# EAGLE design M220C (EAGLE 6.6.0)
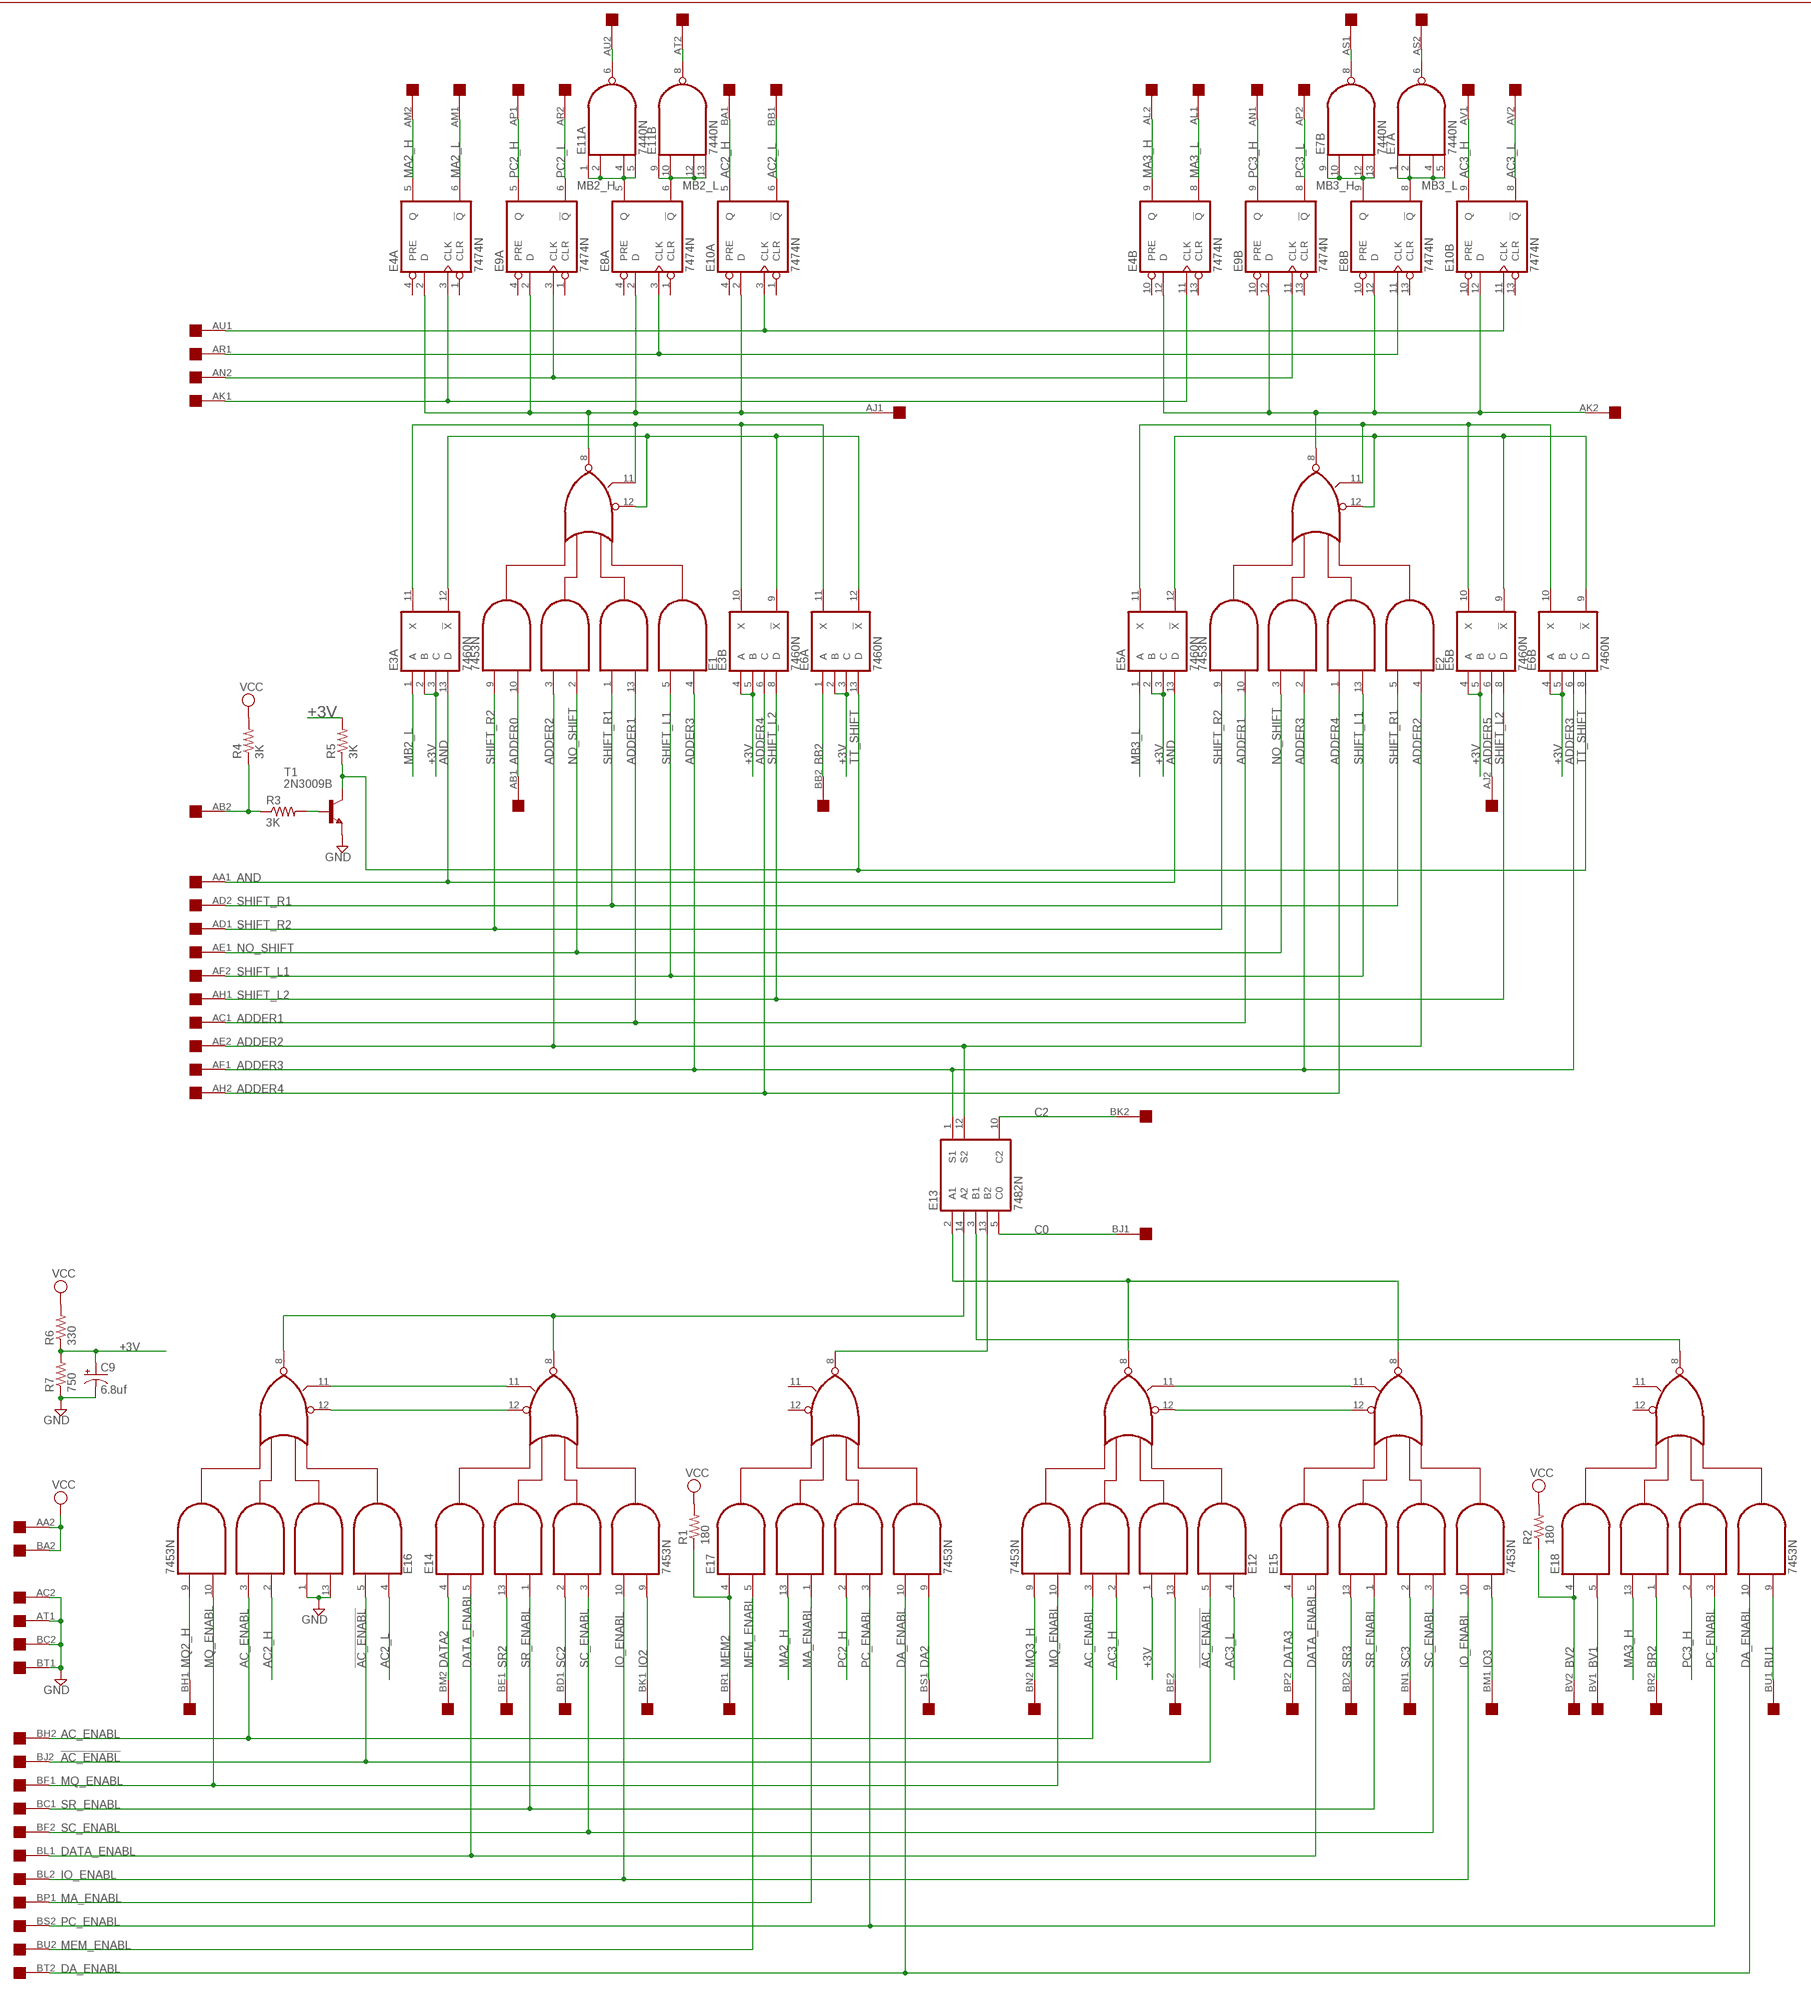
[diagram p0: schematic, sheet 1, part 1 of 2]
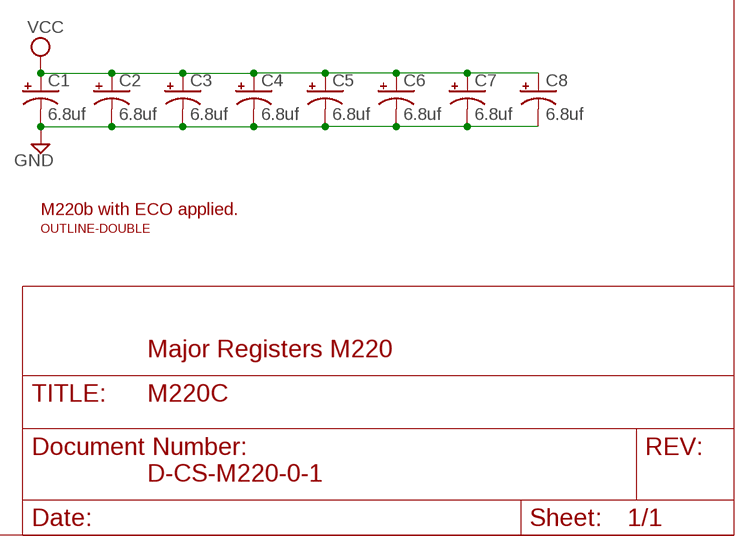
[diagram p1: schematic, sheet 1, part 2 of 2]

## Parts
C1  6.8uf  CPOL-USE15-5AXIAL  [E15-5]
C2  6.8uf  CPOL-USE15-5AXIAL  [E15-5]
C3  6.8uf  CPOL-USE15-5AXIAL  [E15-5]
C4  6.8uf  CPOL-USE15-5AXIAL  [E15-5]
C5  6.8uf  CPOL-USE15-5AXIAL  [E15-5]
C6  6.8uf  CPOL-USE15-5AXIAL  [E15-5]
C7  6.8uf  CPOL-USE15-5AXIAL  [E15-5]
C8  6.8uf  CPOL-USE15-5AXIAL  [E15-5]
C9  6.8uf  CPOL-USE15-5AXIAL  [E15-5]
E1  7453N  [DIL14]
E2  7453N  [DIL14]
E3  7460N  [DIL14]
E4  7474N  74S74N  [DIL14]
E5  7460N  [DIL14]
E6  7460N  [DIL14]
E7  7440N  74S20N  [DIL14]
E8  7474N  74S74N  [DIL14]
E9  7474N  74S74N  [DIL14]
E10  7474N  74S74N  [DIL14]
E11  7440N  74S20N  [DIL14]
E12  7453N  [DIL14]
E13  7482N  [DIL14]
E14  7453N  [DIL14]
E15  7453N  [DIL14]
E16  7453N  [DIL14]
E17  7453N  [DIL14]
E18  7453N  [DIL14]
R1  180  R-US_0207/10  [0207/10]
R2  180  R-US_0207/10  [0207/10]
R3  3K  R-US_0207/10  [0207/10]
R4  3K  R-US_0207/10  [0207/10]
R5  3K  R-US_0207/10  [0207/10]
R6  330  R-US_0207/10  [0207/10]
R7  750  R-US_0207/10  [0207/10]
T1  2N3009B  2N1613  [TO5]
U$1  DOUBLE  [EDGE-CON4]
U$2  OUTLINE-DOUBLE  [DOUBLE]

## Nets
!AC_ENABL: E12.5(I2) E16.5(I2) U$1.BJ2
!TT_SHIFT: R3.1 R4.1 U$1.AB2
+3V [Supply]: C9.+ E3.2(A:B) E3.3(A:C) E3.4(B:A) E3.5(B:B) E5.2(A:B) E5.3(A:C) E5.4(B:A) E5.5(B:B) E6.2(A:B) E6.3(A:C) E6.4(B:A) E6.5(B:B) E12.1(I4) R5.2 R6.1 R7.2
AC2_H: E10.5(A:Q) E16.2(I5) U$1.BA1
AC2_L: E10.6(A:!Q) E16.4(I1) U$1.BB1
AC3_H: E10.9(B:Q) E12.2(I5) U$1.AV1
AC3_L: E10.8(B:!Q) E12.4(I1) U$1.AV2
AC_ENABL: E12.3(I6) E16.3(I6) U$1.BH2
ADDER0: E1.10(I7) U$1.AB1
ADDER1: E1.13(I3) E2.10(I7) U$1.AC1
ADDER2: E1.3(I6) E2.4(I1) E13.12(S2) U$1.AE2
ADDER3: E1.4(I1) E2.2(I5) E6.6(B:C) E13.1(S1) U$1.AF1
ADDER4: E2.1(I4) E3.6(B:C) U$1.AH2
ADDER5: E5.6(B:C) U$1.AJ2
AJ1: E1.8(O) E4.2(A:D) E8.2(A:D) E9.2(A:D) E10.2(A:D) U$1.AJ1
AK1: E4.3(A:CLK) E4.11(B:CLK) U$1.AK1
AK2: E2.8(O) E4.12(B:D) E8.12(B:D) E9.12(B:D) E10.12(B:D) U$1.AK2
AN2: E9.3(A:CLK) E9.11(B:CLK) U$1.AN2
AND: E3.13(A:D) E5.13(A:D) U$1.AA1
AR1: E8.3(A:CLK) E8.11(B:CLK) U$1.AR1
AS1: E7.8(B:O) U$1.AS1
AS2: E7.6(A:O) U$1.AS2
AT2: E11.8(B:O) U$1.AT2
AU1: E10.3(A:CLK) E10.11(B:CLK) U$1.AU1
AU2: E11.6(A:O) U$1.AU2
BB2: E6.1(A:A) U$1.BB2
BE2: E12.13(I3) U$1.BE2
BR2: E18.1(I4) U$1.BR2
BU1: E18.9(I8) U$1.BU1
BV1: E18.5(I2) U$1.BV1
BV2: E18.4(I1) R2.1 U$1.BV2
C0: E13.5(C0) U$1.BJ1
C2: E13.10(C2) U$1.BK2
DA2: E17.9(I8) U$1.BS1
DA_ENABL: E17.10(I7) E18.10(I7) U$1.BT2
DATA2: E14.4(I1) U$1.BM2
DATA3: E15.4(I1) U$1.BP2
DATA_ENABL: E14.5(I2) E15.5(I2) U$1.BL1
GND [Supply]: C1.- C2.- C3.- C4.- C5.- C6.- C7.- C8.- C9.- E16.1(I4) E16.13(I3) R7.1 T1.1(E) U$1.AC2 U$1.AT1 U$1.BC2 U$1.BT1
IO2: E14.9(I8) U$1.BK1
IO3: E15.9(I8) U$1.BM1
IO_ENABL: E14.10(I7) E15.10(I7) U$1.BL2
MA2_H: E4.5(A:Q) E17.13(I3) U$1.AM2
MA2_L: E4.6(A:!Q) U$1.AM1
MA3_H: E4.9(B:Q) E18.13(I3) U$1.AL2
MA3_L: E4.8(B:!Q) U$1.AL1
MA_ENABL: E17.1(I4) U$1.BP1
MB2_H: E8.5(A:Q) E11.1(A:I0) E11.2(A:I1) E11.4(A:I2) E11.5(A:I3)
MB2_L: E3.1(A:A) E8.6(A:!Q) E11.9(B:I0) E11.10(B:I1) E11.12(B:I2) E11.13(B:I3)
MB3_H: E7.9(B:I0) E7.10(B:I1) E7.12(B:I2) E7.13(B:I3) E8.9(B:Q)
MB3_L: E5.1(A:A) E7.1(A:I0) E7.2(A:I1) E7.4(A:I2) E7.5(A:I3) E8.8(B:!Q)
MEM2: E17.4(I1) R1.1 U$1.BR1
MEM_ENABL: E17.5(I2) U$1.BU2
MQ2_H: E16.9(I8) U$1.BH1
MQ3_H: E12.9(I8) U$1.BN2
MQ_ENABL: E12.10(I7) E16.10(I7) U$1.BF1
N$2: E12.12(I9) E15.12(I9)
N$3: R3.2 T1.2(B)
N$4: E12.11(I10) E15.11(I10)
N$5: E13.14(A2) E14.8(O) E16.8(O)
N$6: E14.11(I10) E16.11(I10)
N$7: E14.12(I9) E16.12(I9)
N$8: E12.8(O) E13.2(A1) E15.8(O)
N$9: E2.12(I9) E5.9(B:!X) E5.12(A:!X) E6.9(B:!X)
N$10: E1.12(I9) E3.9(B:!X) E3.12(A:!X) E6.12(A:!X)
N$11: E2.11(I10) E5.10(B:X) E5.11(A:X) E6.10(B:X)
N$12: E13.13(B2) E17.8(O)
N$13: E1.11(I10) E3.10(B:X) E3.11(A:X) E6.11(A:X)
N$14: E13.3(B1) E18.8(O)
NO_SHIFT: E1.2(I5) E2.3(I6) U$1.AE1
PC2_H: E9.5(A:Q) E17.2(I5) U$1.AP1
PC2_L: E9.6(A:!Q) U$1.AR2
PC3_H: E9.9(B:Q) E18.2(I5) U$1.AN1
PC3_L: E9.8(B:!Q) U$1.AP2
PC_ENABL: E17.3(I6) E18.3(I6) U$1.BS2
SC2: E14.2(I5) U$1.BD1
SC3: E15.2(I5) U$1.BN1
SC_ENABL: E14.3(I6) E15.3(I6) U$1.BF2
SHIFT_L1: E1.5(I2) E2.13(I3) U$1.AF2
SHIFT_L2: E3.8(B:D) E5.8(B:D) U$1.AH1
SHIFT_R1: E1.1(I4) E2.5(I2) U$1.AD2
SHIFT_R2: E1.9(I8) E2.9(I8) U$1.AD1
SR2: E14.13(I3) U$1.BE1
SR3: E15.13(I3) U$1.BD2
SR_ENABL: E14.1(I4) E15.1(I4) U$1.BC1
TT_SHIFT: E6.8(B:D) E6.13(A:D) R5.1 T1.3(C)
VCC [Supply]: C1.+ C2.+ C3.+ C4.+ C5.+ C6.+ C7.+ C8.+ R1.2 R2.2 R4.2 R6.2 U$1.AA2 U$1.BA2
Unconnected: E1.6(SPARE) E2.6(SPARE) E4.1(A:CLR) E4.4(A:PRE) E4.10(B:PRE) E4.13(B:CLR) E8.1(A:CLR) E8.4(A:PRE) E8.10(B:PRE) E8.13(B:CLR) E9.1(A:CLR) E9.4(A:PRE) E9.10(B:PRE) E9.13(B:CLR) E10.1(A:CLR) E10.4(A:PRE) E10.10(B:PRE) E10.13(B:CLR) E12.6(SPARE) E13.6 E13.7 E13.8 E13.9 E14.6(SPARE) E15.6(SPARE) E16.6(SPARE) E17.6(SPARE) E17.11(I10) E17.12(I9) E18.6(SPARE) E18.11(I10) E18.12(I9)

## Notes on the sheet
- M220b with ECO applied.
- Major Registers M220
- D-CS-M220-0-1

## Power pins joined to a net without a drawn wire
GND: E1.7(GND) E2.7(GND) E3.7(P:GND) E4.7(P:GND) E5.7(P:GND) E6.7(P:GND) E7.7(P:GND) E8.7(P:GND) E9.7(P:GND) E10.7(P:GND) E11.7(P:GND) E12.7(GND) E13.11(GND) E14.7(GND) E15.7(GND) E16.7(GND) E17.7(GND) E18.7(GND)
VCC: E1.14(VCC) E2.14(VCC) E3.14(P:VCC) E4.14(P:VCC) E5.14(P:VCC) E6.14(P:VCC) E7.14(P:VCC) E8.14(P:VCC) E9.14(P:VCC) E10.14(P:VCC) E11.14(P:VCC) E12.14(VCC) E13.4(VCC) E14.14(VCC) E15.14(VCC) E16.14(VCC) E17.14(VCC) E18.14(VCC)

## Library data of the parts
C1-C9 = dec-con:CPOL-USE15-5AXIAL: 0.6" veresion of an electrolytic
E1 E2 E12 E14-E18 = dec-con:74*53: 4-2-3-2 input AND OR INVERTER gates
E3 E5 E6 = 74xx-us:74*60: Dual 4-input EXPANDER
E4 E8-E10 = 74xx-us:74*74: Dual D type positive edge triggered FLIP FLOP, preset and clear
E7 E11 = 74xx-us:74*20: Dual 4-input NAND gate
E13 = dec-con:74*82: 2-bit binary full ADDER Has the wrong GND pin in other libraries.
R1-R7 = rcl:R-US_: RESISTOR, American symbol
T1 = transistor:2N1613: NPN TRANSISTOR
U$1 = dec-con:DOUBLE: Double-Height DEC board
U$2 = dec-con:OUTLINE-*: Board outlines for DEC boards.

## Net classes
1 Supply: width 0.813 mm

## Board
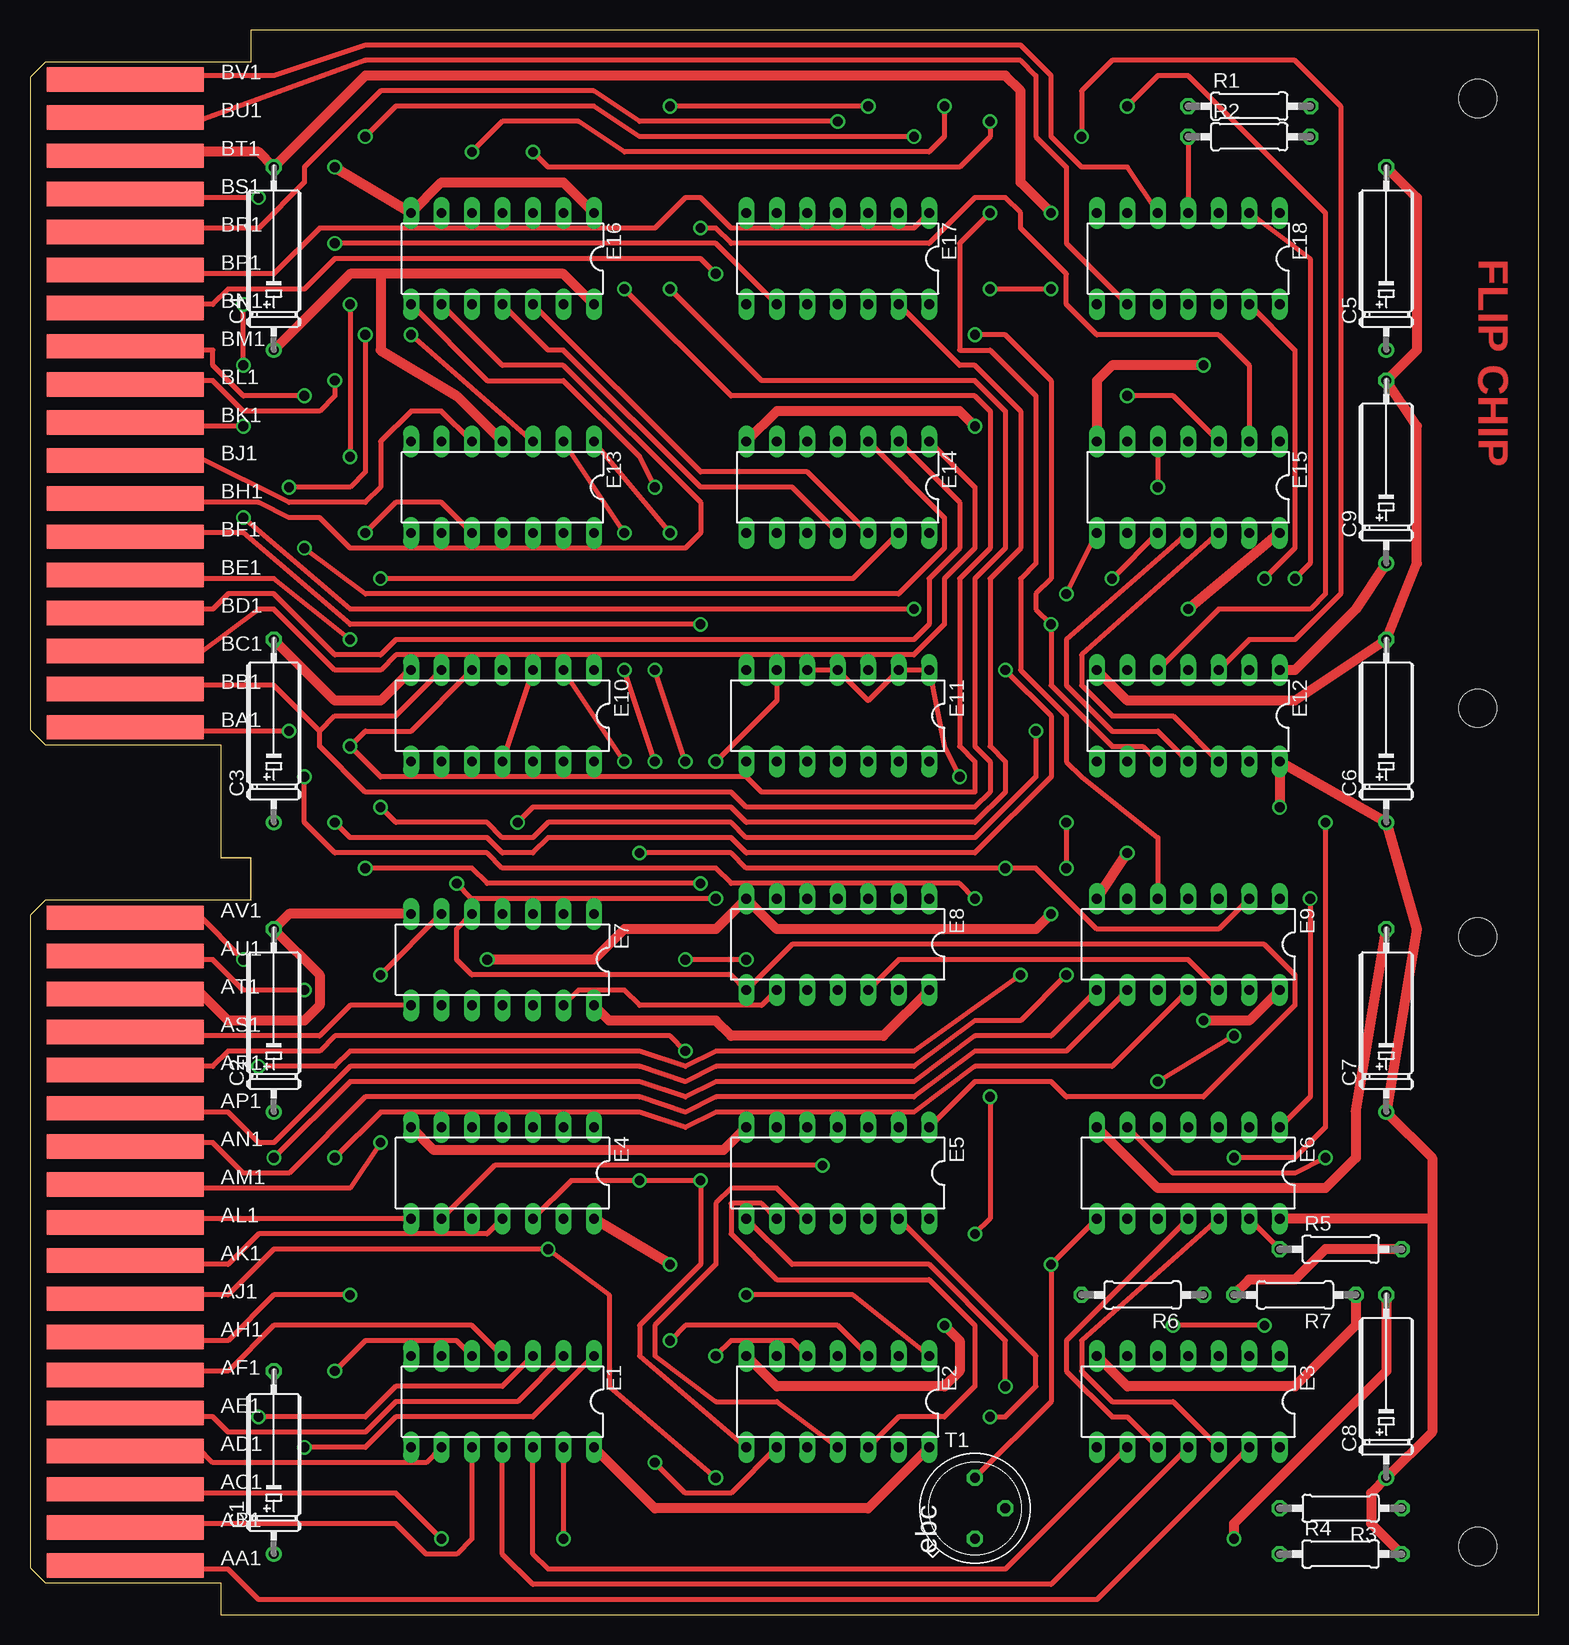
[diagram p2: board, top side]
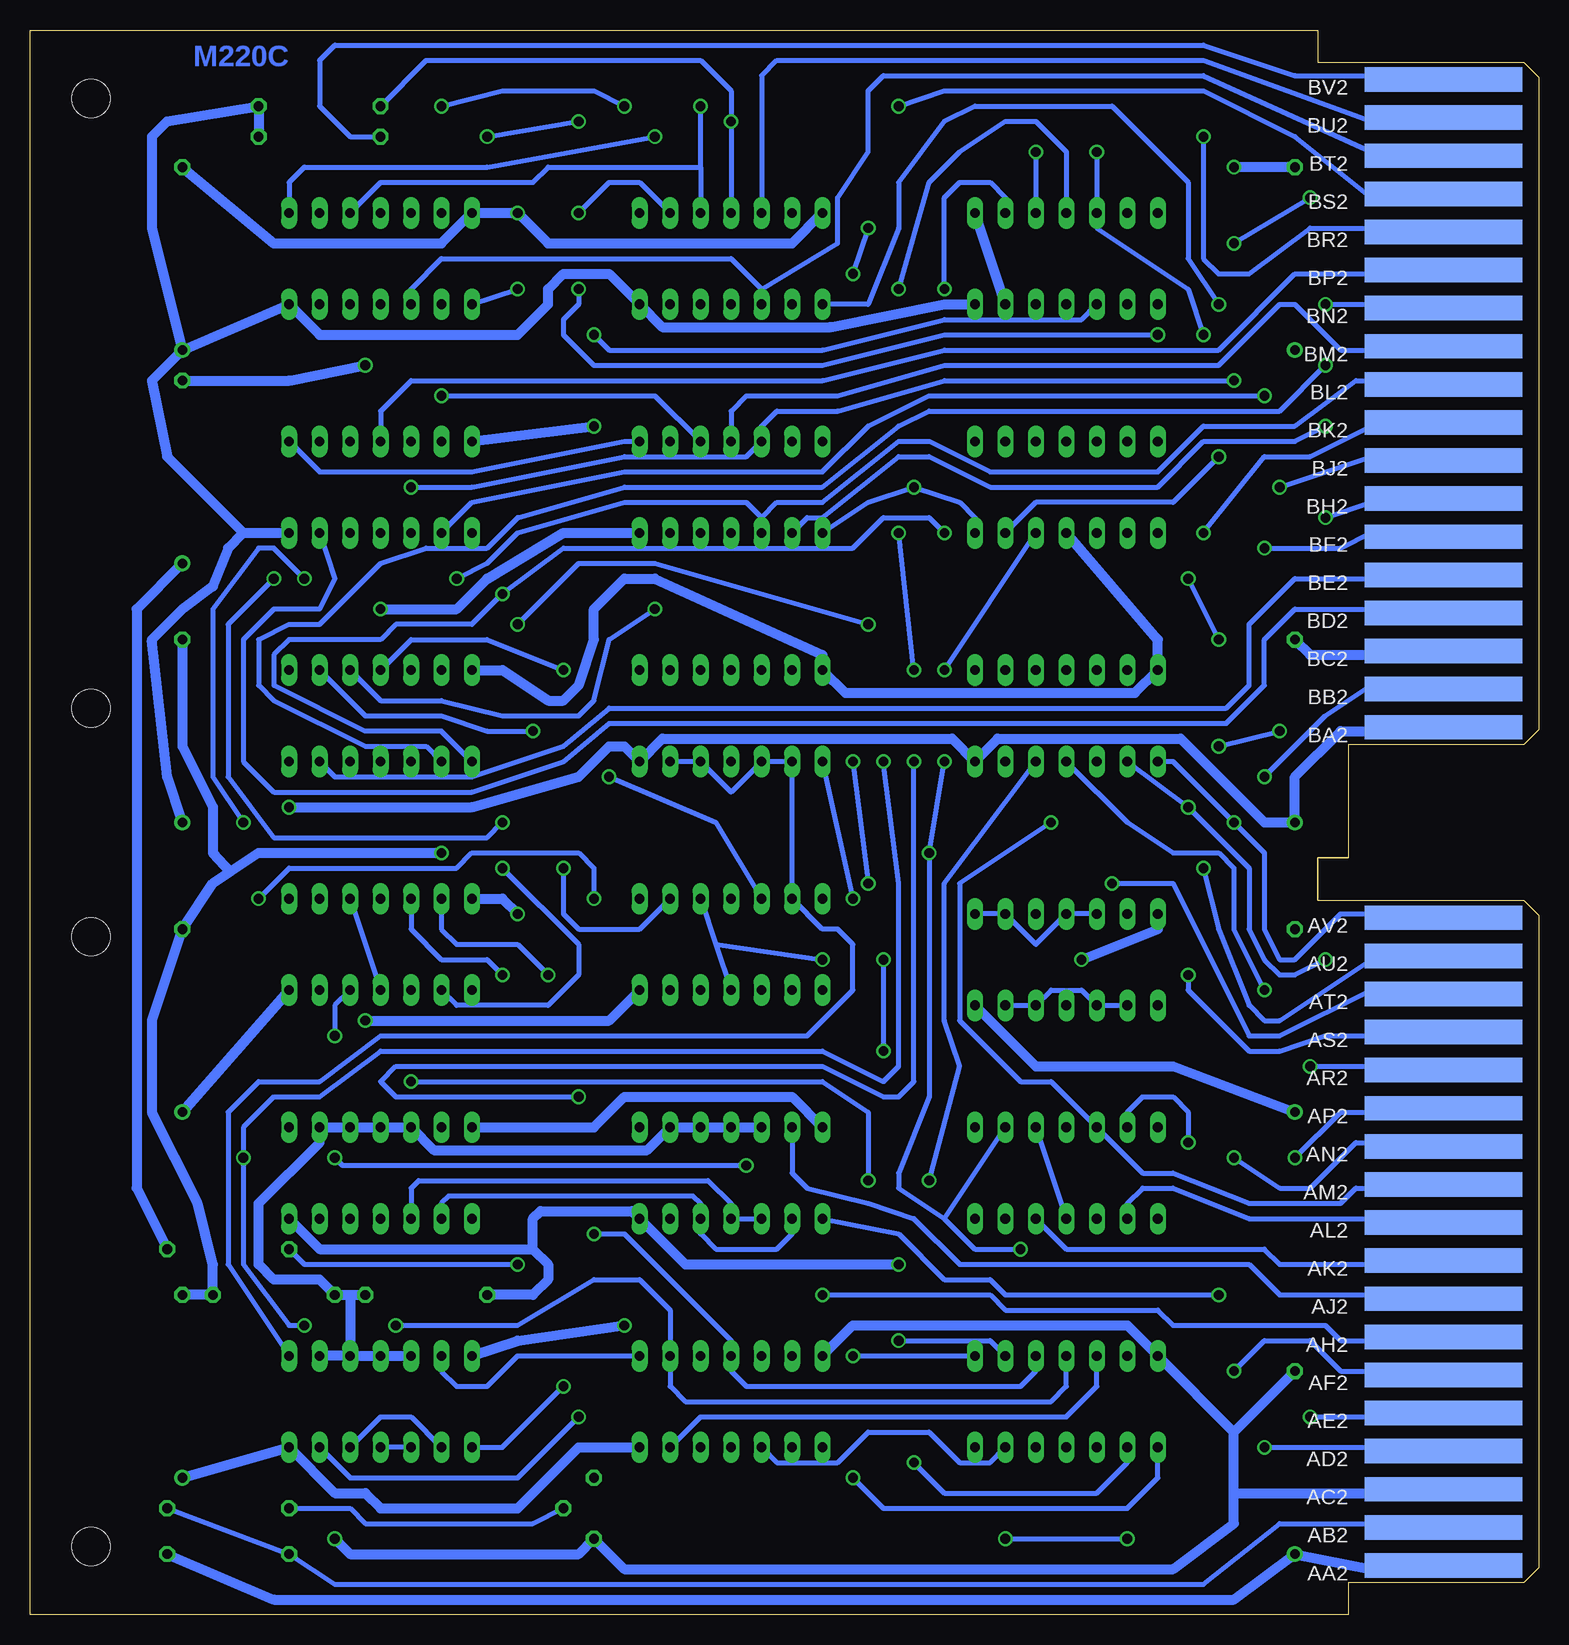
[diagram p3: board, bottom side, seen from below]

Size 125.73 x 132.08 mm. Coordinates in mm from the lower left corner, seen from the top.
Copper layers (1+15+16): Top 0.035mm / dielectric 1.5mm / ECO 0.035mm / dielectric 0.2mm / Bottom 0.035mm
Design rules "16mils *": minimum track width 16mil, minimum drill 32mil, track to track 15mil, track to pad 10mil, pad to pad 10mil, via to via 10mil, smd to smd 10mil, copper to edge 13mil, drill to drill 10mil, minimum pad ring 10mil, minimum via ring 8mil, stop-mask expansion 0mil, vias tented up to drill 0mil, thermal gap 10mil

### Footprints (pad centres in the part's own frame; a part is rotated, then mirrored left to right if it is on the bottom)
E15-5 = drill 0.813: + -7.62,0 | drill 0.813 octagon: - 7.62,0
DIL14 = drill 0.813 long: 1 -7.62,-3.81; 2 -5.08,-3.81; 3 -2.54,-3.81; 4 0,-3.81; 5 2.54,-3.81; 6 5.08,-3.81; 7 7.62,-3.81; 8 7.62,3.81; 9 5.08,3.81; 10 2.54,3.81; 11 0,3.81; 12 -2.54,3.81; 13 -5.08,3.81; 14 -7.62,3.81
0207/10 = drill 0.813 octagon: 1 -5.08,0; 2 5.08,0
TO5 = drill 0.813 octagon: 1 0,-2.54; 2 2.54,0; 3 0,2.54
EDGE-CON4 = smd 13.106 x 2.032: AA1 7.938,4.128; AB1 7.938,7.303; AC1 7.938,10.477; AD1 7.938,13.652; AE1 7.938,16.828; AF1 7.938,20.003; AH1 7.938,23.177; AJ1 7.938,26.352; AK1 7.938,29.527; AL1 7.938,32.703; AM1 7.938,35.877; AN1 7.938,39.053; AP1 7.938,42.227; AR1 7.938,45.403; AS1 7.938,48.578; AT1 7.938,51.752; AU1 7.938,54.928; AV1 7.938,58.102; BA1 7.938,73.978; BB1 7.938,77.153; BC1 7.938,80.328; BD1 7.938,83.502; BE1 7.938,86.677; BF1 7.938,89.853; BH1 7.938,93.028; BJ1 7.938,96.203; BK1 7.938,99.377; BL1 7.938,102.552; BM1 7.938,105.728; BN1 7.938,108.903; BP1 7.938,112.078; BR1 7.938,115.252; BS1 7.938,118.427; BT1 7.938,121.603; BU1 7.938,124.778; BV1 7.938,127.953 | smd 13.106 x 2.032 bottom: AA2 7.938,4.128; AB2 7.938,7.303; AC2 7.938,10.477; AD2 7.938,13.652; AE2 7.938,16.828; AF2 7.938,20.003; AH2 7.938,23.177; AJ2 7.938,26.352; AK2 7.938,29.527; AL2 7.938,32.703; AM2 7.938,35.877; AN2 7.938,39.053; AP2 7.938,42.227; AR2 7.938,45.403; AS2 7.938,48.578; AT2 7.938,51.752; AU2 7.938,54.928; AV2 7.938,58.102; BA2 7.938,73.978; BB2 7.938,77.153; BC2 7.938,80.328; BD2 7.938,83.502; BE2 7.938,86.677; BF2 7.938,89.853; BH2 7.938,93.028; BJ2 7.938,96.203; BK2 7.938,99.377; BL2 7.938,102.552; BM2 7.938,105.728; BN2 7.938,108.903; BP2 7.938,112.078; BR2 7.938,115.252; BS2 7.938,118.427; BT2 7.938,121.603; BU2 7.938,124.778; BV2 7.938,127.953
DOUBLE = hole 3.175: 120.65,56.515; 120.65,5.715; 120.65,75.565; 120.65,126.365

### Placement (x,y rotation side)
C1  20.32,12.7 90 top
C2  20.32,49.53 90 top
C3  20.32,73.66 90 top
C4  20.32,113.03 90 top
C5  113.03,113.03 90 top
C6  113.03,73.66 90 top
C7  113.03,49.53 90 top
C8  113.03,19.05 90 top
C9  113.03,95.25 90 top
E1  39.37,17.78 180 top
E2  67.31,17.78 180 top
E3  96.52,17.78 180 top
E4  39.37,36.83 180 top
E5  67.31,36.83 180 top
E6  96.52,36.83 180 top
E7  39.37,54.61 180 top
E8  67.31,55.88 180 top
E9  96.52,55.88 180 top
E10  39.37,74.93 180 top
E11  67.31,74.93 180 top
E12  96.52,74.93 180 top
E13  39.37,93.98 180 top
E14  67.31,93.98 180 top
E15  96.52,93.98 180 top
E16  39.37,113.03 180 top
E17  67.31,113.03 180 top
E18  96.52,113.03 180 top
R1  101.6,125.73 0 top
R2  101.6,123.19 0 top
R3  109.22,8.89 180 top
R4  109.22,5.08 0 top
R5  109.22,30.48 0 top
R6  92.71,26.67 180 top
R7  105.41,26.67 180 top
T1  78.74,8.89 0 top
U$1  0,0 0 top
U$2  0,0 0 top
U$3  [FLIPCHIP]  125.73,132.08 180 top

### Tracks (layer width: path | path; a pad name or v marks a point on that pad's centre or on a via)
!AC_ENABL  (via drill 0.81)
  Top 0.406: v36.83,121.92 39.37,124.46 45.72,124.46 49.53,121.92 74.93,121.92 76.2,123.19 v76.2,125.73 | v91.44,125.73 93.98,128.27 96.52,128.27 107.95,116.84 107.95,85.09 106.68,83.82 99.06,83.82 E12.5 | v21.59,93.98 26.67,93.98 27.94,95.25 v27.94,106.68
  Bottom 0.406: v36.83,121.92 E16.5 36.83,115.57 29.21,110.49 v27.94,106.68 | U$1.BJ2 8.89,96.52 13.97,96.52 v21.59,93.98 | v91.44,125.73 86.36,127 78.74,127 v76.2,125.73
!TT_SHIFT
  Bottom 0.406: R3.1 R4.1 100.33,2.54 27.94,2.54 21.59,7.62 10.16,7.62
  Bottom 0.813: 10.16,7.62 U$1.AB2
+3V
  Top 0.813: R5.2 107.95,30.48 105.41,27.94 101.6,27.94 R7.2 | E12.1 105.41,78.74 110.49,83.82 C9.+
  Bottom 0.813: E3.5 E3.4 E3.3 | E3.3 E3.2 | 99.06,26.67 R7.2 101.6,27.94 105.41,27.94 106.68,29.21 106.68,34.29 101.6,39.37 E6.2 E6.3 E6.4 E6.5 92.08,38.73 74.3,38.73 E5.2 E5.3 E5.4 E5.5 | 99.06,26.67 R6.1 | 99.06,26.67 E3.3 | C9.+ 116.84,83.82 116.84,35.56 R5.2
AC2_H  (via drill 0.81)
  Top 0.406: U$1.BA1 8.89,73.66 v21.59,73.66 | v49.53,110.49 58.42,101.6 78.74,101.6 80.01,100.33 80.01,88.9 77.47,86.36 77.47,72.39 78.74,71.12 78.74,68.58 60.96,68.58 59.69,69.85 29.21,69.85 v26.67,72.39 27.94,73.66 31.75,73.66 E10.5
  Bottom 0.406: E16.2 44.45,118.11 45.72,119.38 48.26,119.38 49.53,118.11 v49.53,110.49 | v26.67,72.39 v21.59,73.66
AC2_L  (via drill 0.81)
  Top 0.406: U$1.BB1 8.89,77.47 20.32,77.47 24.13,73.66 | 24.13,73.66 24.13,72.39 27.94,68.58 58.42,68.58 59.69,67.31 78.74,67.31 80.01,68.58 80.01,71.12 78.74,72.39 78.74,86.36 81.28,88.9 81.28,100.33 78.74,102.87 60.96,102.87 v53.34,110.49 | E10.6 30.48,74.93 25.4,74.93 24.13,73.66
  Bottom 0.406: E16.4 39.37,121.92 41.91,124.46 44.45,124.46 48.26,121.92 50.8,119.38 v53.34,110.49
AC3_H  (via drill 0.81)
  Top 0.406: U$1.AV1 8.06,58.42 13.97,58.42 v17.78,54.61 | v29.21,67.31 30.48,66.04 38.1,66.04 39.37,64.77 41.91,64.77 43.18,66.04 58.42,66.04 59.69,64.77 78.74,64.77 83.82,69.85 v83.82,73.66
  Bottom 0.406: E10.9 v29.21,67.31 24.13,62.23 24.13,57.15 22.86,54.61 21.59,53.34 20.32,53.34 v17.78,54.61 | E12.2 97.79,74.93 91.44,74.93 87.63,73.66 v83.82,73.66
AC3_L  (via drill 0.81)
  Top 0.406: v25.4,66.04 26.67,64.77 38.1,64.77 39.37,63.5 41.91,63.5 43.18,64.77 58.42,64.77 59.69,63.5 78.74,63.5 85.09,69.85 85.09,74.93 v81.28,78.74
  Bottom 0.406: U$1.AV2 8.5,58.03 8.89,58.42 16.51,58.42 20.32,54.61 21.59,54.61 22.86,57.15 22.86,63.5 v25.4,66.04 30.48,71.12 E10.8 | E12.4 93.98,81.28 87.63,81.28 v81.28,78.74
AC_ENABL  (via drill 0.81)
  Top 0.406: v41.91,121.92 43.18,120.65 77.47,120.65 80.01,123.19 v80.01,124.46 | E12.3 101.6,81.28 105.41,81.28 109.22,85.09 109.22,125.73 105.41,129.54 90.17,129.54 87.63,127 v87.63,123.19 | v73.66,83.82 26.67,83.82 v17.78,91.44
  Bottom 0.406: E12.3 96.52,76.2 91.44,76.2 86.36,74.93 80.01,74.93 78.74,76.2 77.47,81.28 v73.66,83.82 | v41.91,121.92 E16.3 | U$1.BH2 8.89,92.71 13.97,92.71 v17.78,91.44 | v87.63,123.19 v80.01,124.46
ADDER0
  Top 0.406: 8.89,7.62 30.48,7.62 33.02,5.08 35.56,5.08 36.83,6.35 E1.10
  Top 0.813: 8.89,7.62 U$1.AB1
ADDER1  (via drill 0.81)
  Top 0.406: E1.13 v44.45,6.35 | U$1.AC1 8.89,10.16 30.48,10.16 v34.29,6.35
  Bottom 0.406: v44.45,6.35 v34.29,6.35 | E1.13 45.72,12.7 48.26,12.7 50.8,15.24 55.88,15.24 58.42,12.7 63.5,12.7 E2.10
ADDER2  (via drill 0.81)
  Top 0.406: v78.74,31.75 80.01,33.02 v80.01,43.18 | v19.05,16.51 27.94,16.51 30.48,19.05 39.37,19.05 E1.3 | v52.07,71.12 v49.53,78.74
  Bottom 0.406: E1.3 41.91,20.32 43.18,19.05 66.04,19.05 67.31,20.32 E2.4 67.31,22.86 76.2,31.75 v78.74,31.75 | U$1.AE2 11.1,16.84 11.43,16.51 v19.05,16.51 | v49.53,78.74 E13.12 | v80.01,43.18 95.25,43.18 96.52,44.45 95.25,45.72 59.69,45.72 54.61,43.18 53.34,43.18 52.07,44.45 v52.07,71.12
ADDER3  (via drill 0.81)
  Top 0.406: v102.87,24.13 v95.25,24.13 | U$1.AF1 10.16,20.32 16.51,20.32 20.32,24.13 36.83,24.13 E1.4 | E6.6 95.25,36.83 105.41,36.83 v107.95,38.1 | v54.61,71.12 v52.07,78.74 | v53.34,90.17 E13.1
  Bottom 0.406: E1.4 39.37,19.05 40.64,17.78 71.12,17.78 72.39,19.05 E2.2 72.39,25.4 74.93,27.94 78.74,27.94 85.09,24.13 v95.25,24.13 | v102.87,24.13 104.14,24.13 107.95,29.21 v107.95,38.1 107.95,40.64 105.41,43.18 101.6,43.18 96.52,46.99 59.69,46.99 54.61,44.45 53.34,45.72 53.34,60.96 v54.61,71.12 | v52.07,78.74 v53.34,90.17
ADDER4  (via drill 0.81)
  Top 0.406: v59.69,26.67 68.58,26.67 E2.1
  Bottom 0.406: E3.6 91.44,20.32 90.17,19.05 87.63,19.05 85.09,21.59 E2.1 | U$1.AH2 9.83,23.19 10.16,22.86 16.51,22.86 17.78,24.13 30.48,24.13 31.75,25.4 44.45,25.4 45.72,26.67 v59.69,26.67
ADDER5
  Bottom 0.406: U$1.AJ2 8.56,26.34 8.89,26.67 21.59,26.67 24.13,29.21 48.26,29.21 52.07,33.02 55.88,34.29 60.96,35.56 62.23,36.83 E5.6
AJ1  (via drill 0.81)
  Top 0.406: v57.15,11.43 48.26,19.05 48.26,26.67 v43.18,30.48 20.32,30.48 16.51,26.67 8.89,26.67 U$1.AJ1 | v50.8,63.5 58.42,63.5 59.69,62.23 v81.28,62.23 83.82,62.23 88.9,57.15 99.06,57.15 E9.2 | v49.53,71.12 E10.2
  Bottom 0.406: E1.8 31.75,11.43 34.29,8.89 54.61,8.89 v57.15,11.43 | E8.2 74.93,57.15 80.01,57.15 81.28,58.42 v81.28,62.23 | 49.53,33.02 E4.2 | 49.53,33.02 46.99,30.48 v43.18,30.48 | 49.53,33.02 53.34,35.56 53.34,36.83 50.8,43.18 v50.8,63.5 v49.53,71.12
AK1
  Top 0.406: U$1.AK1 8.89,29.21 16.51,29.21 19.05,31.75 38.1,31.75 E4.11
  Bottom 0.406: E4.3 E4.11
AK2  (via drill 0.81)
  Top 0.406: v100.33,48.26 v93.98,44.45 | E4.12 45.09,36.2 v50.8,36.2 v55.88,36.2 55.88,29.21 50.8,24.13 50.8,21.59 E2.8 | E8.12 72.39,54.61 96.52,54.61 E9.12
  Bottom 0.406: U$1.AK2 9.86,29.52 10.16,29.21 21.59,29.21 22.86,30.48 39.37,30.48 E4.12 | E9.12 100.33,50.8 v100.33,48.26 | E10.12 49.53,60.96 49.53,49.53 48.26,45.72 v50.8,36.2 | v93.98,44.45 59.69,44.45 55.88,41.91 v55.88,36.2
AN2  (via drill 0.81)
  Top 0.406: v25.4,38.1 29.21,41.91 50.8,41.91 54.61,40.64 57.15,41.91 73.66,41.91 78.74,45.72 90.17,45.72 E9.11
  Bottom 0.406: E9.3 E9.11 | U$1.AN2 9.83,39.04 10.16,39.37 15.24,39.37 19.05,35.56 21.59,35.56 v25.4,38.1
AND  (via drill 0.81)
  Top 0.406: U$1.AA1 8.49,4.21 8.89,3.81 16.51,3.81 19.05,1.27 88.9,1.27 E3.13 | E5.13 83.82,21.59 83.82,19.05 81.28,16.51 v80.01,16.51
  Bottom 0.406: E3.13 99.06,11.43 85.09,11.43 v80.01,16.51
AR1  (via drill 0.81)
  Top 0.406: v59.69,54.61 v54.61,54.61 | v54.61,46.99 53.34,48.26 25.4,48.26 24.13,46.99 16.51,46.99 15.24,45.72 8.89,45.72 U$1.AR1
  Bottom 0.406: E8.3 68.58,55.88 | 68.58,55.88 E8.11 | 68.58,55.88 v59.69,54.61 | v54.61,54.61 v54.61,46.99
AS1
  Top 0.406: U$1.AS1 8.89,48.26 24.13,48.26 26.67,50.8 E7.8
AS2  (via drill 0.81)
  Top 0.406: E7.6 v29.21,53.34
  Bottom 0.406: U$1.AS2 8.59,48.56 8.89,48.26 17.78,48.26 21.59,46.99 24.13,46.99 29.21,52.07 v29.21,53.34
AT2  (via drill 0.81)
  Top 0.406: v35.56,60.96 36.83,59.69 v57.15,59.69
  Bottom 0.406: E11.8 v57.15,59.69 | U$1.AT2 8.89,52.07 13.97,52.07 21.59,48.26 24.13,48.26 30.48,60.96 v35.56,60.96
AU1  (via drill 0.81)
  Top 0.406: U$1.AU1 8.02,54.61 15.24,54.61 17.78,52.07 v22.86,52.07 | E10.3 E10.11
  Bottom 0.406: v22.86,52.07 25.4,57.15 25.4,62.23 26.67,63.5 30.48,63.5 34.29,66.04 E10.11
AU2  (via drill 0.81)
  Top 0.406: v27.94,62.23 36.83,62.23 38.1,60.96 v55.88,60.96 | v57.15,71.12 62.23,76.2 E11.6
  Bottom 0.406: U$1.AU2 8.89,54.61 13.97,54.61 21.59,49.53 22.86,49.53 24.13,50.8 26.67,57.15 v27.94,62.23 | v57.15,71.12 v55.88,60.96
BB2  (via drill 0.81)
  Top 0.406: E6.1 106.68,43.18 v106.68,59.69 | v78.74,59.69 77.47,60.96 58.42,60.96 57.15,62.23 39.37,62.23 38.1,63.5 25.4,63.5 22.86,66.04 v22.86,69.85
  Bottom 0.406: U$1.BB2 8.89,77.47 13.97,77.47 17.78,74.93 v22.86,69.85 | v106.68,59.69 104.14,62.23 90.17,62.23 88.9,63.5 80.01,63.5 78.74,62.23 v78.74,59.69
BE2
  Bottom 0.406: U$1.BE2 8.89,86.36 20.32,86.36 24.13,82.55 24.13,77.47 26.04,75.56 77.47,75.56 81.28,72.39 88.9,69.85 100.33,69.85 E12.13
BR2  (via drill 0.81)
  Top 0.406: v73.66,123.19 50.8,123.19 46.99,125.73 30.48,125.73 v27.94,123.19
  Bottom 0.406: E18.1 104.14,119.38 102.87,120.65 87.63,120.65 v73.66,123.19 | U$1.BR2 8.89,115.57 19.05,115.57 24.13,111.76 26.67,111.76 27.94,113.03 v27.94,123.19
BU1
  Top 0.406: U$1.BU1 8.89,124.46 13.97,124.46 27.94,129.54 82.55,129.54 83.82,128.27 83.82,123.19 86.36,120.65 86.36,114.3 E18.9
BV1
  Top 0.406: U$1.BV1 8.89,128.27 20.32,128.27 27.94,130.81 82.55,130.81 85.09,128.27 85.09,123.19 87.63,120.65 91.44,120.65 E18.5
BV2
  Top 0.406: R2.1 E18.4
  Bottom 0.406: U$1.BV2 8.5,127.88 8.89,128.27 20.32,128.27 27.94,130.81 100.33,130.81 101.6,129.54 101.6,125.73 99.06,123.19 R2.1
C0
  Top 0.406: U$1.BJ1 8,96.52 13.97,96.52 21.59,92.71 27.94,92.71 29.21,93.98 29.21,97.79 31.75,100.33 34.29,100.33 E13.5
C2  (via drill 0.81)
  Top 0.406: v27.94,90.17 30.48,92.71 34.29,92.71 E13.10
  Bottom 0.406: U$1.BK2 8.89,99.06 13.97,99.06 19.05,96.52 22.86,96.52 v27.94,90.17
DA2  (via drill 0.81)
  Top 0.406: U$1.BS1 8.89,118.11 v19.05,118.11 | v25.4,114.3 57.15,114.3 E17.9
  Bottom 0.406: v25.4,114.3 v19.05,118.11
DA_ENABL
  Bottom 0.406: U$1.BT2 8.89,121.92 13.97,121.92 27.94,128.27 54.61,128.27 55.88,127 55.88,121.92 58.42,118.11 58.42,114.3 64.77,110.49 | 64.77,110.49 E17.10 | E18.10 93.98,110.49 91.44,113.03 67.31,113.03 64.77,110.49
DATA2
  Bottom 0.406: U$1.BM2 8.89,105.41 16.51,105.41 20.32,109.22 21.59,109.22 26.67,104.14 49.53,104.14 58.42,101.6 66.04,101.6 67.31,100.33 E14.4
DATA3
  Bottom 0.406: U$1.BP2 10.16,111.76 20.32,111.76 26.67,105.41 49.53,105.41 59.69,102.87 93.98,102.87 96.52,100.33 E15.4
DATA_ENABL  (via drill 0.81)
  Top 0.406: E15.5 v93.98,93.98 | U$1.BL1 8.02,102.87 15.24,102.87 17.78,100.33 24.13,100.33 25.4,101.6 v25.4,102.87
  Bottom 0.406: v25.4,102.87 49.53,102.87 58.42,100.33 63.5,100.33 64.77,99.06 E14.5 66.04,96.52 76.2,96.52 88.9,93.98 v93.98,93.98
GND  (via drill 0.81)
  Top 0.813: v25.4,120.65 E16.7 34.29,119.38 44.45,119.38 E16.1 | U$1.BT1 8.89,121.92 19.05,121.92 C4.- 27.94,128.27 81.28,128.27 82.55,127 82.55,119.38 v85.09,116.84 | v78.74,99.06 77.47,100.33 62.23,100.33 E14.7 | v100.33,6.35 100.33,7.62 113.03,20.32 C8.- | E3.7 91.44,19.05 105.41,19.05 110.49,24.13 R7.1 | v91.44,63.5 E9.7 | v85.09,58.42 83.82,57.15 62.23,57.15 E8.7 57.15,57.15 49.53,57.15 46.99,54.61 v38.1,54.61 | C5.- 115.57,118.11 115.57,105.41 C9.- 115.57,99.06 115.57,87.63 C6.- 105.41,76.2 91.44,76.2 E12.7 | E15.7 88.9,102.87 90.17,104.14 v97.79,104.14 | E4.7 33.66,38.73 57.79,38.73 E5.7 | E6.7 93.98,35.56 107.95,35.56 110.49,38.1 110.49,41.91 C7.- | v76.2,24.13 77.47,22.86 77.47,20.32 76.2,19.05 62.23,19.05 E2.7 | E7.7 21.59,58.42 C2.- 24.13,53.34 24.13,50.8 22.86,49.53 16.51,49.53 13.97,52.07 8.89,52.07 U$1.AT1 | E10.7 29.21,76.2 25.4,76.2 C3.-
  Bottom 0.813: C8.- R7.1 110.49,29.21 111.76,34.29 115.57,41.91 115.57,49.53 C7.- 110.49,60.96 109.03,61.94 | U$1.AC2 8.89,10.16 25.4,10.16 | 25.4,10.16 25.4,7.62 30.48,3.81 76.2,3.81 T1.1 80.01,5.08 99.06,5.08 v100.33,6.35 | 25.4,15.24 C1.- | 25.4,10.16 25.4,15.24 | 25.4,15.24 E1.7 34.29,24.13 57.15,24.13 E2.7 | E3.7 85.09,22.86 v76.2,24.13 | E16.1 E16.13 | E7.7 31.75,57.15 v38.1,54.61 | E9.7 86.36,59.69 v85.09,58.42 | v91.44,63.5 106.68,63.5 109.03,61.94 | E12.7 86.36,78.74 82.55,76.2 81.28,76.2 80.01,77.47 78.74,81.28 78.74,83.82 76.2,86.36 73.66,86.36 59.69,80.01 E11.7 57.79,76.83 33.66,76.83 E10.7 31.75,81.28 E13.11 | U$1.BC2 8.89,80.01 19.05,80.01 C3.- | C4.- v25.4,120.65 | E17.7 62.23,114.3 82.55,114.3 v85.09,116.84 E18.7 91.44,114.3 105.41,114.3 C5.- | E15.7 v78.74,99.06 | E6.7 78.74,40.64 76.2,43.18 62.23,43.18 E5.7 | C9.- 104.14,102.87 v97.79,104.14 | C6.- 113.03,72.39 110.49,67.31 110.49,63.5 109.03,61.94
IO2  (via drill 0.81)
  Top 0.406: U$1.BK1 7.97,99.06 v17.78,99.06
  Bottom 0.406: E14.9 60.96,91.44 59.69,91.44 53.34,96.52 50.8,96.52 45.72,93.98 31.75,93.98 27.94,97.79 20.32,97.79 v17.78,99.06
IO3  (via drill 0.81)
  Top 0.406: U$1.BM1 8.02,105.41 15.24,105.41 15.24,104.14 17.78,101.6 v22.86,101.6
  Bottom 0.406: E15.9 88.9,92.71 76.2,95.25 59.69,95.25 55.88,99.06 50.8,101.6 v22.86,101.6
IO_ENABL  (via drill 0.81)
  Top 0.406: E15.10 v90.17,86.36
  Bottom 0.406: U$1.BL2 8.89,102.87 15.24,102.87 20.32,99.06 27.94,99.06 31.75,95.25 45.72,95.25 50.8,97.79 53.34,97.79 59.69,92.71 63.5,92.71 64.77,91.44 | 64.77,91.44 E14.10 | 64.77,91.44 66.04,92.71 76.2,92.71 85.09,90.17 87.63,87.63 v90.17,86.36
MA2_H  (via drill 0.81)
  Top 0.406: v40.64,66.04 41.91,67.31 58.42,67.31 59.69,66.04 78.74,66.04 81.28,68.58 81.28,71.12 80.01,72.39 80.01,86.36 82.55,88.9 82.55,100.33 78.74,104.14 77.47,104.14 E17.13
  Bottom 0.406: U$1.AM2 8.56,35.89 8.89,35.56 15.24,35.56 16.51,34.29 24.13,34.29 30.48,36.83 33.02,36.83 E4.5 40.64,44.45 43.18,44.45 48.26,49.53 48.26,60.96 v40.64,66.04
MA2_L  (via drill 0.81)
  Top 0.406: U$1.AM1 8.89,35.56 26.67,35.56 v29.21,39.37
  Bottom 0.406: E4.6 34.29,41.91 33.02,43.18 30.48,43.18 29.21,41.91 v29.21,39.37
MA3_H  (via drill 0.81)
  Top 0.406: E18.13 105.41,105.41 105.41,88.9 v102.87,86.36 | v107.95,66.04 107.95,40.64 105.41,38.1 v100.33,38.1 | v66.04,37.47 38.74,37.47 E4.9
  Bottom 0.406: U$1.AL2 8.56,32.69 8.89,33.02 24.13,33.02 30.48,35.56 33.02,35.56 34.29,34.29 E4.9 | v102.87,86.36 105.41,88.9 106.68,88.9 110.49,83.82 110.49,69.85 v107.95,66.04 | v100.33,38.1 99.7,37.47 v66.04,37.47
MA3_L
  Top 0.406: U$1.AL1 8.89,33.02 E4.8
MA_ENABL
  Top 0.406: U$1.BP1 8.89,111.76 20.32,111.76 24.13,115.57 52.07,115.57 54.61,118.11 55.88,118.11 58.42,115.57 73.66,115.57 E17.1
MB2_H  (via drill 0.81)
  Top 0.406: v77.47,69.85 76.2,72.39 E11.1 E11.2 69.85,76.2 E11.4 E11.5
  Bottom 0.406: E8.5 68.58,66.04 v77.47,69.85
MB2_L
  Bottom 0.406: E3.1 109.22,29.21 109.22,41.91 106.68,44.45 101.6,44.45 96.52,48.26 60.96,48.26 57.15,52.07 57.15,55.88 58.42,57.15 59.69,57.15 E8.6 E11.9 E11.10 67.31,68.58 E11.12 E11.13
MB3_H
  Top 0.406: E8.9 60.96,50.8 50.8,50.8 49.53,52.07 45.72,52.07 E7.13
  Bottom 0.406: E7.9 E7.10 38.1,52.07 40.64,52.07 E7.12 E7.13
MB3_L
  Top 0.406: E5.1 78.74,44.45 85.09,44.45 86.36,43.18 97.79,43.18 105.41,50.8 105.41,53.34 102.87,55.88 63.5,55.88 E8.8 58.42,53.34 36.83,53.34 35.56,54.61 35.56,57.15 E7.5
  Bottom 0.406: E7.5 E7.4 41.91,55.88 E7.2 E7.1
MEM2  (via drill 0.81)
  Top 0.406: v67.31,124.46 50.8,124.46 46.99,127 29.21,127 22.86,120.65 22.86,119.38 19.05,115.57 8,115.57 U$1.BR1
  Bottom 0.406: R1.1 92.71,129.54 69.85,129.54 67.31,127 v67.31,124.46 E17.4
MEM_ENABL
  Bottom 0.406: U$1.BU2 8.89,124.46 13.97,124.46 27.94,129.54 63.5,129.54 64.77,128.27 E17.5
MQ2_H
  Top 0.406: U$1.BH1 8,92.71 19.05,92.71 21.59,91.44 24.13,91.44 26.67,88.9 54.61,88.9 55.88,90.17 55.88,92.71 44.45,104.14 39.37,104.14 E16.9
MQ3_H  (via drill 0.81)
  Top 0.406: v17.78,104.14 v17.78,109.22
  Bottom 0.406: E12.9 92.71,72.39 97.79,72.39 105.41,76.2 106.68,77.47 106.68,81.28 104.14,82.55 101.6,82.55 96.52,87.63 92.71,88.9 87.63,88.9 85.09,91.44 76.2,93.98 59.69,93.98 53.34,99.06 50.8,100.33 21.59,100.33 v17.78,104.14 | U$1.BN2 8.89,109.22 v17.78,109.22
MQ_ENABL  (via drill 0.81)
  Top 0.406: v78.74,106.68 81.28,106.68 85.09,102.87 85.09,86.36 83.82,85.09 83.82,83.82 v85.09,82.55 85.09,77.47 90.17,72.39 92.71,72.39 E12.10 | v55.88,82.55 26.67,82.55 17.78,90.17 8.89,90.17 U$1.BF1
  Bottom 0.406: E16.10 38.1,107.95 49.53,107.95 59.69,105.41 77.47,105.41 v78.74,106.68 | v85.09,82.55 80.01,87.63 73.66,87.63 v55.88,82.55
N$2
  Top 0.406: E15.12 87.63,80.01 87.63,77.47 90.17,74.93 95.25,74.93 E12.12
N$3
  Bottom 0.406: R3.2 99.06,8.89 97.79,7.62 83.82,7.62 T1.2
N$4
  Top 0.406: E12.11 93.98,73.66 90.17,73.66 86.36,77.47 86.36,81.28 E15.11
N$5  (via drill 0.81)
  Top 0.406: E16.8 38.1,102.87 44.45,102.87 50.8,96.52 v52.07,93.98
  Bottom 0.406: E14.8 55.88,92.71 v52.07,93.98 48.26,92.71 46.99,91.44 E13.14
N$6
  Top 0.406: E16.11 43.18,105.41 44.45,105.41 55.88,93.98 63.5,93.98 E14.11
N$7
  Top 0.406: E16.12 55.88,95.25 64.77,95.25 E14.12
N$8  (via drill 0.81)
  Top 0.406: E15.8 v86.36,85.09 | v49.53,90.17 E13.2
  Bottom 0.406: v49.53,90.17 50.8,91.44 54.61,91.44 57.15,88.9 81.28,88.9 v86.36,85.09 88.9,82.55 95.25,82.55 96.52,81.28 104.14,81.28 105.41,80.01 105.41,77.47 97.79,73.66 92.71,73.66 91.44,73.66 E12.8
N$9
  Top 0.406: E2.12 72.39,16.51 76.2,16.51 78.74,19.05 78.74,24.13 74.93,27.94 62.23,27.94 58.42,31.75 58.42,34.29 60.96,34.29 E5.9
  Bottom 0.406: E5.9 62.23,31.75 63.5,30.48 68.58,30.48 69.85,31.75 E5.12 69.85,34.29 70.49,34.92 90.81,34.92 91.44,34.29 E6.9
N$10
  Top 0.406: E1.12 41.91,5.08 43.18,3.81 81.28,3.81 E3.9 | E6.12 87.63,22.86 87.63,20.32 90.17,17.78 95.25,17.78 E3.12
  Bottom 0.406: E3.12 96.52,16.51 93.98,16.51 E3.9
N$11
  Top 0.406: E2.11 62.23,17.78 57.15,17.78 52.07,21.59 52.07,24.13 57.15,29.21 57.15,34.29 58.42,35.56 62.23,35.56 E5.10
  Bottom 0.406: E5.10 E5.11 67.31,34.29 69.22,36.2 93.35,36.2 93.98,35.56 E6.10
N$12  (via drill 0.81)
  Top 0.406: v26.67,109.22 v26.67,96.52
  Bottom 0.406: E17.8 55.88,109.22 53.34,115.57 53.34,119.38 49.53,124.46 46.99,125.73 35.56,125.73 29.21,119.38 29.21,113.03 v26.67,109.22 | E13.13 41.91,92.71 30.48,92.71 v26.67,96.52
N$13
  Top 0.406: E3.11 85.09,2.54 41.91,2.54 39.37,5.08 E1.11 | E6.11 86.36,22.86 86.36,20.32 90.17,16.51 91.44,16.51 E3.10
  Bottom 0.406: E3.10 E3.11
N$14  (via drill 0.81)
  Top 0.406: v31.75,106.68 E13.3 | v85.09,110.49 v80.01,110.49
  Bottom 0.406: E18.8 v85.09,110.49 | v31.75,106.68 49.53,106.68 59.69,104.14 78.74,104.14 81.28,106.68 81.28,107.95 80.01,109.22 v80.01,110.49
NO_SHIFT  (via drill 0.81)
  Top 0.406: v53.34,22.86 54.61,24.13 67.31,24.13 E2.3 | U$1.AE1 8.89,16.51 15.24,16.51 16.51,15.24 27.94,15.24 30.48,17.78 40.64,17.78 E1.2
  Bottom 0.406: E1.2 45.72,22.86 v53.34,22.86
PC2_H  (via drill 0.81)
  Top 0.406: U$1.AP1 8.89,41.91 16.51,41.91 19.05,39.37 20.32,39.37 26.67,45.72 50.8,45.72 54.61,44.45 57.15,45.72 73.66,45.72 78.74,49.53 82.55,49.53 v86.36,53.34 | E9.5 93.98,64.77 87.63,69.85 86.36,71.12 86.36,74.93 82.55,78.74 82.55,86.36 83.82,87.63 83.82,101.6 80.01,105.41 77.47,105.41 77.47,114.3 v80.01,116.84
  Bottom 0.406: E9.5 93.98,57.15 91.44,54.61 87.63,54.61 v86.36,53.34 | E17.2 74.93,119.38 77.47,119.38 v80.01,116.84
PC2_L  (via drill 0.81)
  Top 0.406: v82.55,53.34 73.66,46.99 57.15,46.99 54.61,45.72 50.8,46.99 26.67,46.99 25.4,45.72 v19.05,45.72
  Bottom 0.406: U$1.AR2 8.56,45.39 8.89,45.72 v19.05,45.72 | E9.6 91.44,57.15 90.17,55.88 85.09,55.88 v82.55,53.34
PC3_H  (via drill 0.81)
  Top 0.406: v86.36,66.04 v86.36,62.23 | U$1.AN1 8.89,39.37 15.24,39.37 17.78,36.83 21.59,36.83 27.94,43.18 50.8,43.18 54.61,41.91 57.15,43.18 73.66,43.18 78.74,46.99 86.36,46.99 E9.9 | E18.2 106.68,113.03 106.68,87.63 v105.41,86.36
  Bottom 0.406: E9.9 90.17,50.8 82.55,50.8 80.01,53.34 80.01,55.88 v86.36,62.23 | v86.36,66.04 87.63,64.77 105.41,64.77 109.22,69.85 109.22,82.55 v105.41,86.36
PC3_L  (via drill 0.81)
  Top 0.406: v20.32,38.1 26.67,44.45 50.8,44.45 54.61,43.18 57.15,44.45 73.66,44.45 78.74,48.26 85.09,48.26 E9.8
  Bottom 0.406: U$1.AP2 8.56,42.24 8.89,41.91 16.51,41.91 v20.32,38.1
PC_ENABL  (via drill 0.81)
  Top 0.406: v69.85,125.73 v53.34,125.73
  Bottom 0.406: U$1.BS2 8.89,118.11 13.97,118.11 20.32,123.19 27.94,127 49.53,127 v53.34,125.73 | 69.85,120.65 v69.85,125.73 | 69.85,120.65 E17.3 | E18.3 96.52,119.38 83.82,119.38 82.55,120.65 69.85,120.65
SC2
  Top 0.406: E14.2 77.47,92.71 77.47,88.9 74.93,86.36 74.93,82.55 73.66,81.28 30.48,81.28 29.21,80.01 25.4,80.01 20.32,85.09 16.51,85.09 15.24,83.82 8.89,83.82 U$1.BD1
SC3  (via drill 0.81)
  Top 0.406: E15.2 101.6,104.14 99.06,106.68 88.9,106.68 86.36,109.22 86.36,111.76 82.55,115.57 82.55,116.84 81.28,118.11 78.74,118.11 74.93,114.3 58.42,114.3 57.15,115.57 v55.88,115.57 | U$1.BN1 8.02,109.22 15.24,109.22 16.51,110.49 22.86,110.49 25.4,113.03 55.88,113.03 v57.15,111.76
  Bottom 0.406: v55.88,115.57 v57.15,111.76
SC_ENABL  (via drill 0.81)
  Top 0.406: v91.44,101.6 95.25,101.6 E15.3 | E14.3 76.2,91.44 76.2,88.9 72.39,85.09 27.94,85.09 v22.86,88.9
  Bottom 0.406: E14.3 73.66,101.6 v91.44,101.6 | U$1.BF2 8.89,90.17 13.97,90.17 16.51,88.9 v22.86,88.9
SHIFT_L1  (via drill 0.81)
  Top 0.406: v25.4,20.32 27.94,22.86 35.56,22.86 E1.5
  Bottom 0.406: E1.5 36.83,19.05 39.37,16.51 69.85,16.51 E2.13 | U$1.AF2 9.88,20.04 10.16,20.32 16.51,20.32 19.05,22.86 22.86,22.86 v25.4,20.32
SHIFT_L2  (via drill 0.81)
  Top 0.406: E5.8 63.5,29.21 74.93,29.21 81.28,22.86 v81.28,19.05 | U$1.AH1 8.89,22.86 16.51,22.86 20.32,26.67 v26.67,26.67
  Bottom 0.406: E3.8 86.36,13.97 v81.28,19.05 | E5.8 53.34,31.75 49.53,27.94 45.72,27.94 44.45,26.67 v26.67,26.67
SHIFT_R1  (via drill 0.81)
  Top 0.406: v22.86,13.97 27.94,13.97 30.48,16.51 41.91,16.51 E1.1 | v57.15,21.59 58.42,22.86 63.5,22.86 E2.5
  Bottom 0.406: U$1.AD2 8.59,13.66 8.89,13.97 v22.86,13.97 | v57.15,21.59 E1.1
SHIFT_R2  (via drill 0.81)
  Top 0.406: U$1.AD1 9.86,13.66 10.16,13.97 13.97,13.97 15.24,12.7 33.02,12.7 E1.9 | v52.07,12.7 54.61,10.16 58.42,10.16 E2.9
  Bottom 0.406: E1.9 34.29,12.7 36.83,10.16 49.53,10.16 v52.07,12.7
SR2  (via drill 0.81)
  Top 0.406: E14.13 68.58,86.36 v29.21,86.36 | U$1.BE1 8.89,86.36 20.32,86.36 v26.67,81.28
  Bottom 0.406: v29.21,86.36 v26.67,81.28
SR3
  Bottom 0.406: E15.13 100.33,86.36 101.6,83.82 105.41,83.82 107.95,81.28 107.95,71.12 105.41,68.58 88.9,68.58 81.28,71.12 77.47,74.3 26.04,74.3 22.86,77.47 22.86,81.28 20.32,83.82 8.89,83.82 U$1.BD2
SR_ENABL
  Top 0.406: E14.1 78.74,93.98 78.74,88.9 76.2,86.36 76.2,82.55 73.66,80.01 30.48,80.01 29.21,78.74 25.4,78.74 20.32,83.82 19.05,83.82 13.97,80.01 8.89,80.01 U$1.BC1
  Bottom 0.406: E14.1 76.2,97.79 88.9,95.25 101.6,95.25 E15.1
TT_SHIFT  (via drill 0.81)
  Top 0.406: E6.13 R5.1 | T1.3 85.09,17.78 v85.09,29.21 E6.8
  Bottom 0.406: R5.1 102.87,29.21 v85.09,29.21
VCC  (via drill 0.81)
  Top 0.813: R4.2 111.76,7.62 111.76,10.16 C8.+ 116.84,15.24 116.84,33.02 | 116.84,33.02 E6.14 | 116.84,33.02 116.84,38.1 C7.+ 115.57,57.15 C6.+ E12.14 v104.14,67.31 | C4.+ 26.67,111.76 29.21,111.76 | 29.21,111.76 44.45,111.76 E16.14 | E2.14 69.85,8.89 52.07,8.89 E1.14 | v97.79,49.53 101.6,49.53 E9.14 | v53.34,29.21 E4.14 | E7.14 48.26,49.53 57.15,49.53 58.42,48.26 71.12,48.26 E8.14 | E15.14 v96.52,83.82 | E13.4 35.56,101.6 29.21,105.41 29.21,111.76
  Bottom 0.813: R2.2 R1.2 114.3,124.46 115.57,123.19 115.57,115.57 C5.+ | C5.+ 115.57,102.87 114.3,96.52 107.95,90.17 | 107.95,90.17 109.22,88.9 110.49,85.72 113.03,83.82 115.57,81.28 114.3,69.85 C6.+ | 107.95,90.17 E15.14 | C5.+ E18.14 101.6,106.68 85.09,106.68 82.55,109.22 82.55,110.49 81.28,111.76 77.47,111.76 E17.14 73.03,107.31 59.06,107.31 49.53,109.22 E16.14 | C8.+ E3.14 100.33,10.16 97.79,10.16 96.52,8.89 85.09,8.89 80.01,13.97 E2.14 | U$1.AA2 8.89,3.81 13.97,3.81 C1.+ 25.4,1.27 105.41,1.27 R4.2 | R6.2 83.82,26.67 82.55,27.94 82.55,29.21 83.82,30.48 | 83.82,30.48 101.6,30.48 E6.14 | 83.82,30.48 83.82,33.02 83.19,33.66 75.57,33.66 E5.14 71.12,29.21 v53.34,29.21 | C2.+ 30.48,45.72 41.91,45.72 E7.14 | E8.14 77.47,49.53 v97.79,49.53 | U$1.BA2 8.49,74.06 8.89,73.66 16.51,73.66 20.32,69.85 C3.+ 22.86,66.04 29.85,73.03 45.09,73.03 E10.14 48.9,73.03 73.03,73.03 E11.14 76.2,72.39 77.47,72.39 80.01,69.85 88.9,67.31 v104.14,67.31 | E14.14 81.28,90.17 87.63,86.36 90.17,83.82 v96.52,83.82 | E9.14 C7.+

### Text on the board
Bottom: M220C
tPlace: ebc